# EAGLE design Cansat2019_3279_Container_v01 (EAGLE 7.3.0)
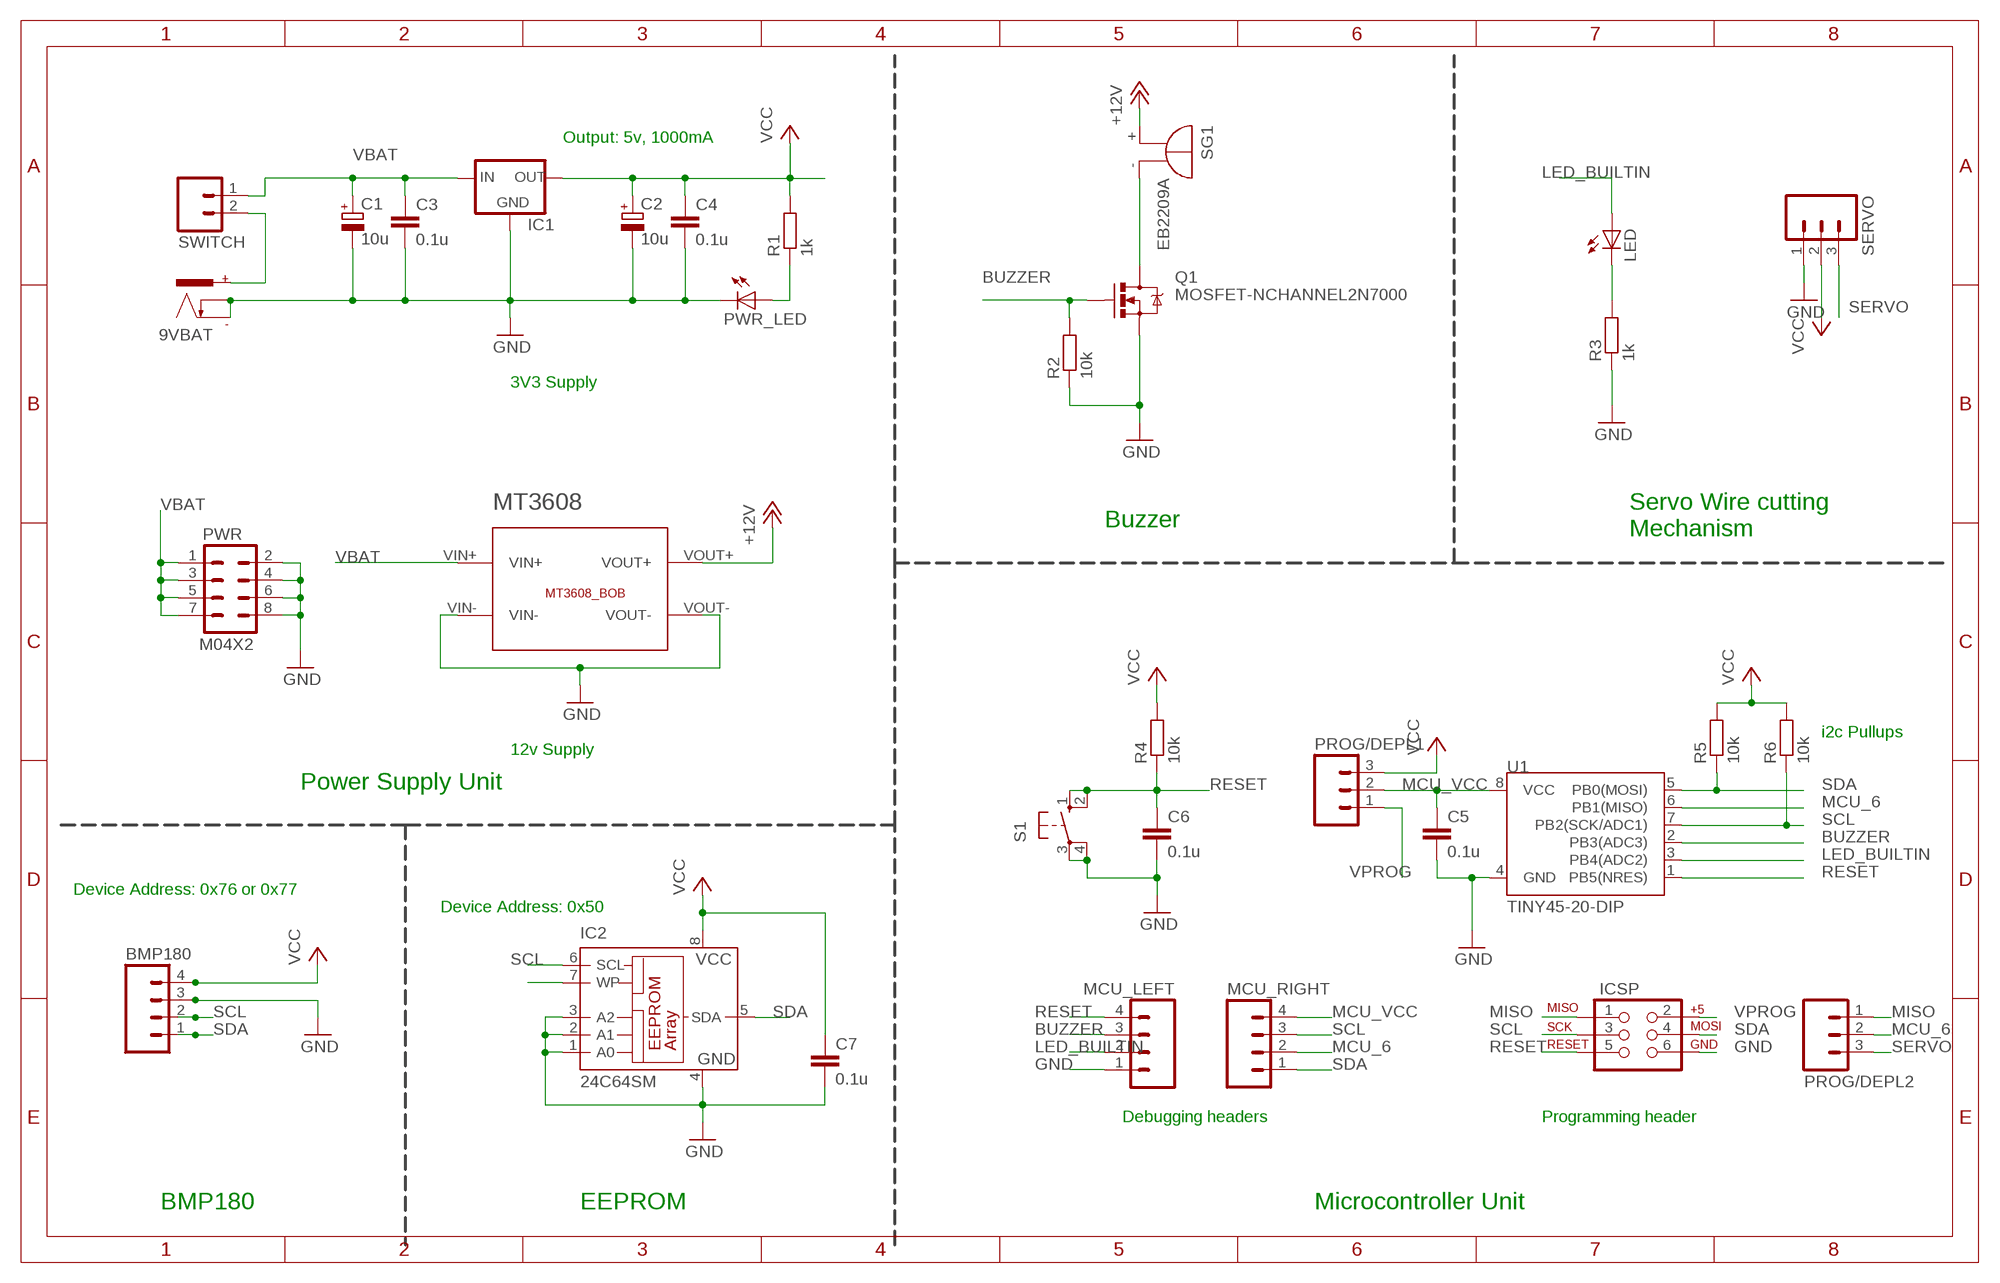
[diagram p0: schematic, sheet 1]

## Parts
9VBAT  POWER_CON  [NEB21R]
BMP180  M04  [04P]
C1  10u  CPOL-EUE2.5-6  [E2,5-6]
C2  10u  CPOL-EUE2.5-6  [E2,5-6]
C3  0.1u  C-EU025-025X050  [C025-025X050]
C4  0.1u  C-EU025-025X050  [C025-025X050]
C5  0.1u  C-EU025-025X050  [C025-025X050]
C6  0.1u  C-EU025-025X050  [C025-025X050]
C7  0.1u  C-EU025-025X050  [C025-025X050]
IC1  V_REG_78XX-TO-220  [TO-220-ALT]
IC2  24C64SM  [SO-08M]
ICSP  AVR_SPI_PRG_6NS  [2X3-NS]
LED  LED3MM  [LED3MM]
MCU_LEFT  M04  [04P]
MCU_RIGHT  M04  [04P]
MT3608  MT3608_BOB  [MT3608_BOB]
PROG/DEPL1  M03PTH  [1X03]
PROG/DEPL2  M03PTH  [1X03]
PWR  M04X2  [2X4]
PWR_LED  LED3MM  [LED3MM]
Q1  MOSFET-NCHANNEL2N7000  [TO-92]
R1  1k  R-EU_0204/7  [0204/7]
R2  10k  R-EU_0204/7  [0204/7]
R3  1k  R-EU_0204/7  [0204/7]
R4  10k  R-EU_0204/7  [0204/7]
R5  10k  R-EU_0204/7  [0204/7]
R6  10k  R-EU_0204/7  [0204/7]
S1  PUSH-BUTTON-6MM  [B3F-10XX]
SERVO  M03  [03P]
SG1  EB2209A  [EB2209A]
SWITCH  M02  [02P]
U1  TINY45-20-DIP  ATTINY45TINY45-20-DIP  [DIP08]

## Nets
+12V [power]: MT3608.VOUT+ SG1.+
BUZZER: MCU_LEFT.3 Q1.2(G) R2.2 U1.2(PB3(ADC3))
GND [power]: 9VBAT.- 9VBAT.C BMP180.3 C1.- C2.- C3.2 C4.2 C5.2 C6.2 C7.2 IC1.GND IC2.1(A0) IC2.2(A1) IC2.3(A2) IC2.4(GND) ICSP.6 MCU_LEFT.1 MT3608.VIN- MT3608.VOUT- PWR.2 PWR.4 PWR.6 PWR.8 PWR_LED.K(C) Q1.1(S) R2.1 R3.1 S1.3(P) S1.4(P1) SERVO.1 U1.4(GND)
LED_BUILTIN: LED.A MCU_LEFT.2 U1.3(PB4(ADC2))
MCU_6: MCU_RIGHT.2 PROG/DEPL2.2 U1.6(PB1(MISO))
MCU_VCC [power]: C5.1 MCU_RIGHT.4 PROG/DEPL1.2 U1.8(VCC)
MISO: ICSP.1 PROG/DEPL2.1
N$1 [power]: Q1.3(D) SG1.-
N$2: LED.K(C) R3.2
N$3: PWR_LED.A R1.1
N$6 [burner]: 9VBAT.+ SWITCH.2
N$8: IC2.7(WP)
RESET: C6.1 ICSP.5 MCU_LEFT.4 R4.1 S1.1(S) S1.2(S1) U1.1(PB5(NRES))
SCL: BMP180.2 IC2.6(SCL) ICSP.3 MCU_RIGHT.3 R6.1 U1.7(PB2(SCK/ADC1))
SDA: BMP180.1 IC2.5(SDA) ICSP.4 MCU_RIGHT.1 R5.1 U1.5(PB0(MOSI))
SERVO: PROG/DEPL2.3 SERVO.3
VBAT [power]: C1.+ C3.1 IC1.IN MT3608.VIN+ PWR.1 PWR.3 PWR.5 PWR.7 SWITCH.1
VCC [power]: BMP180.4 C2.+ C4.1 C7.1 IC1.OUT IC2.8(VCC) PROG/DEPL1.3 R1.2 R4.2 R5.2 R6.2 SERVO.2
VPROG [power]: ICSP.2 PROG/DEPL1.1

## Notes on the sheet
- Output: 5v, 1000mA
- 3V3 Supply
- Buzzer
- Servo Wire cutting
  Mechanism
- i2c Pullups
- 12v Supply
- Power Supply Unit
- Device Address: 0x76 or 0x77
- Device Address: 0x50
- Debugging headers | Programming header
- BMP180 | EEPROM | Microcontroller Unit

## Library data of the parts
9VBAT = CEDT_JANUARY_2015_v5:POWER_CON: DC Power Connector
BMP180 MCU_LEFT MCU_RIGHT = con-amp-quick:M04: AMP QUICK CONNECTOR; OC_FARNELL: unknown; OC_NEWARK: unknown
C1 C2 = rcl:CPOL-EU: POLARIZED CAPACITOR, European symbol
C3-C7 = rcl:C-EU: CAPACITOR, European symbol
IC1 = 1 - Jim:V_REG_78XX: Voltage Regulator Standard 7805 5V regulator. IGO (Input Ground Output). Spark Fun Electronics SKU : COM-00107
IC2 = microchip:24*: Serial EEPROM I2C; MF: RAMTRON INTERNATIONAL CORP; MPN: FM24C64-S; OC_FARNELL: 9882685; OC_NEWARK: 98H0189
ICSP = SparkFun-Connectors:AVR_SPI_PRG_6: AVR ISP 6 Pin This is the reduced ISP connector for AVR programming. Common on Arduino. This footprint will take up less PCB space and can be used with a 10-pin to 6-pin adapter such as SKU: BOB-08508 **Special note about "TEST_POINT" package. The stop mask is on the top side, so if you want your programming test points to be on the bottom of your board, make sure to place this package on the bottom side of the board. This also ensure that the orientation to program from the bottom side will be correct.
LED PWR_LED = 01_adafruit:LED: LED OSRAM: - CHIPLED LG R971, LG N971, LY N971, LG Q971, LY Q971, LO R971, LY R971 LH N974, LH R974 LS Q976, LO Q976, LY Q976 LO Q996 - Hyper CHIPLED LW Q18S LB Q993, LB Q99A, LB R99A - SideLED LS A670, LO A670, LY A670, LG A670, LP A670 LB A673, LV A673, LT A673, LW A673 LH A674 LY A675 LS A676, LA A676, LO A676, LY A676, LW A676 LS A679, LY A679, LG A679 - Hyper Micro SIDELED® LS Y876, LA Y876, LO Y876, LY Y876 LT Y87S - SmartLED LW L88C, LW L88S LB L89C, LB L89S, LG L890 LS L89K, LO L89K, LY L89K LS L896, LA L896, LO L896, LY L896 - TOPLED LS T670, LO T670, LY T670, LG T670, LP T670 LSG T670, LSP T670, LSY T670, LOP T670, LYG T670 LG T671, LOG T671, LSG T671 LB T673, LV T673, LT T673, LW T673 LH T674 LS T676, LA T676, LO T676, LY T676, LB T676, LH T676, LSB T676, LW T676 LB T67C, LV T67C, LT T67C, LS T67K, LO T67K, LY T67K, LW E67C LS E67B, LA E67B, LO E67B, LY E67B, LB E67C, LV E67C, LT E67C LW T67C LS T679, LY T679, LG T679 LS T770, LO T770, LY T770, LG T770, LP T770 LB T773, LV T773, LT T773, LW T773 LH T774 LS E675, LA E675, LY E675, LS T675 LS T776, LA T776, LO T776, LY T776, LB T776 LHGB T686 LT T68C, LB T68C - Hyper Mini TOPLED® LB M676 - Mini TOPLED Santana® LG M470 LS M47K, LO M47K, LY M47K Source: http://www.osram.convergy.de/
MT3608 = Breakouts:MT3608_BOB
PROG/DEPL1 PROG/DEPL2 = SparkFun-Connectors:M03: Header 3 Standard 3-pin 0.1" header. Use with straight break away headers (SKU : PRT-00116), right angle break away headers (PRT-00553), swiss pins (PRT-00743), machine pins (PRT-00117), and female headers (PRT-00115). Molex polarized connector foot print use with SKU : PRT-08232 with associated crimp pins and housings.
PWR = SparkFun-Connectors:M04X2: .1" header, two rows of four.
Q1 = SparkFun-DiscreteSemi:MOSFET-NCHANNEL: Common NMOSFET Parts MFG P/N Store ID Prod ID FDD8780 TRANS-09984 SI7820DN TRANS-11055 FDS6630A IC-08089 2N7002PW TRANS-11151 FQP30N06L COM-10213 TRANS-10060 BSS123LT1G TRANS-08345 BSS138 TRANS-00830 BS170 2N7000
R1-R6 = rcl:R-EU_: RESISTOR, European symbol
S1 = msp framework:PUSH-BUTTON: Tactile Switch Momentary Push to ON switch Omron B3F 10-xx & 40-xx Datasheet <http://www.omron.com/ecb/products/pdf/en-b3f.pdf>; SUNROM: 3951
SERVO = msp framework:M03: AMP QUICK CONNECTOR
SG1 = buzzer:EB2209A: BUZZER Source: Buerklin; OC_FARNELL: unknown; OC_NEWARK: unknown
SWITCH = CEDT_JANUARY_2015_v5:M02: AMP QUICK CONNECTOR
U1 = SparkFun-DigitalIC:ATTINY45: Atmel 8-pin 2/4/8kB flash uC; PROD_ID: IC-09439

## Net classes
0 default: width 0.305 mm, clearance 0.305 mm
1 power: width 0.61 mm, clearance 0.305 mm
2 burner: width 0.813 mm, clearance 0.305 mm

## Board
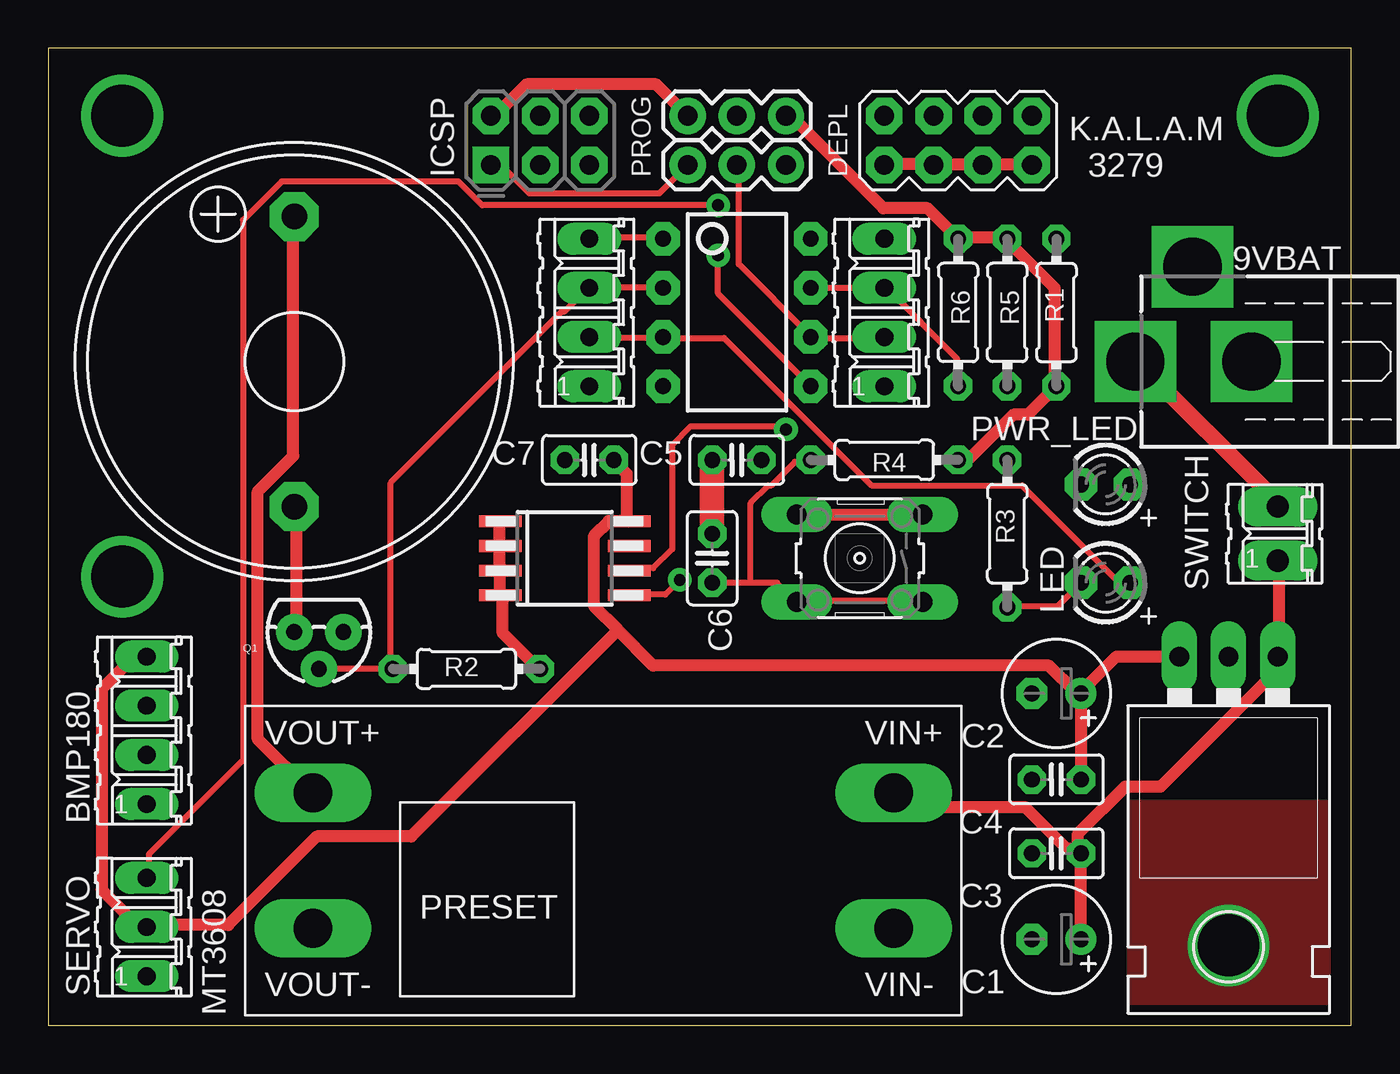
[diagram p1: board, top side]
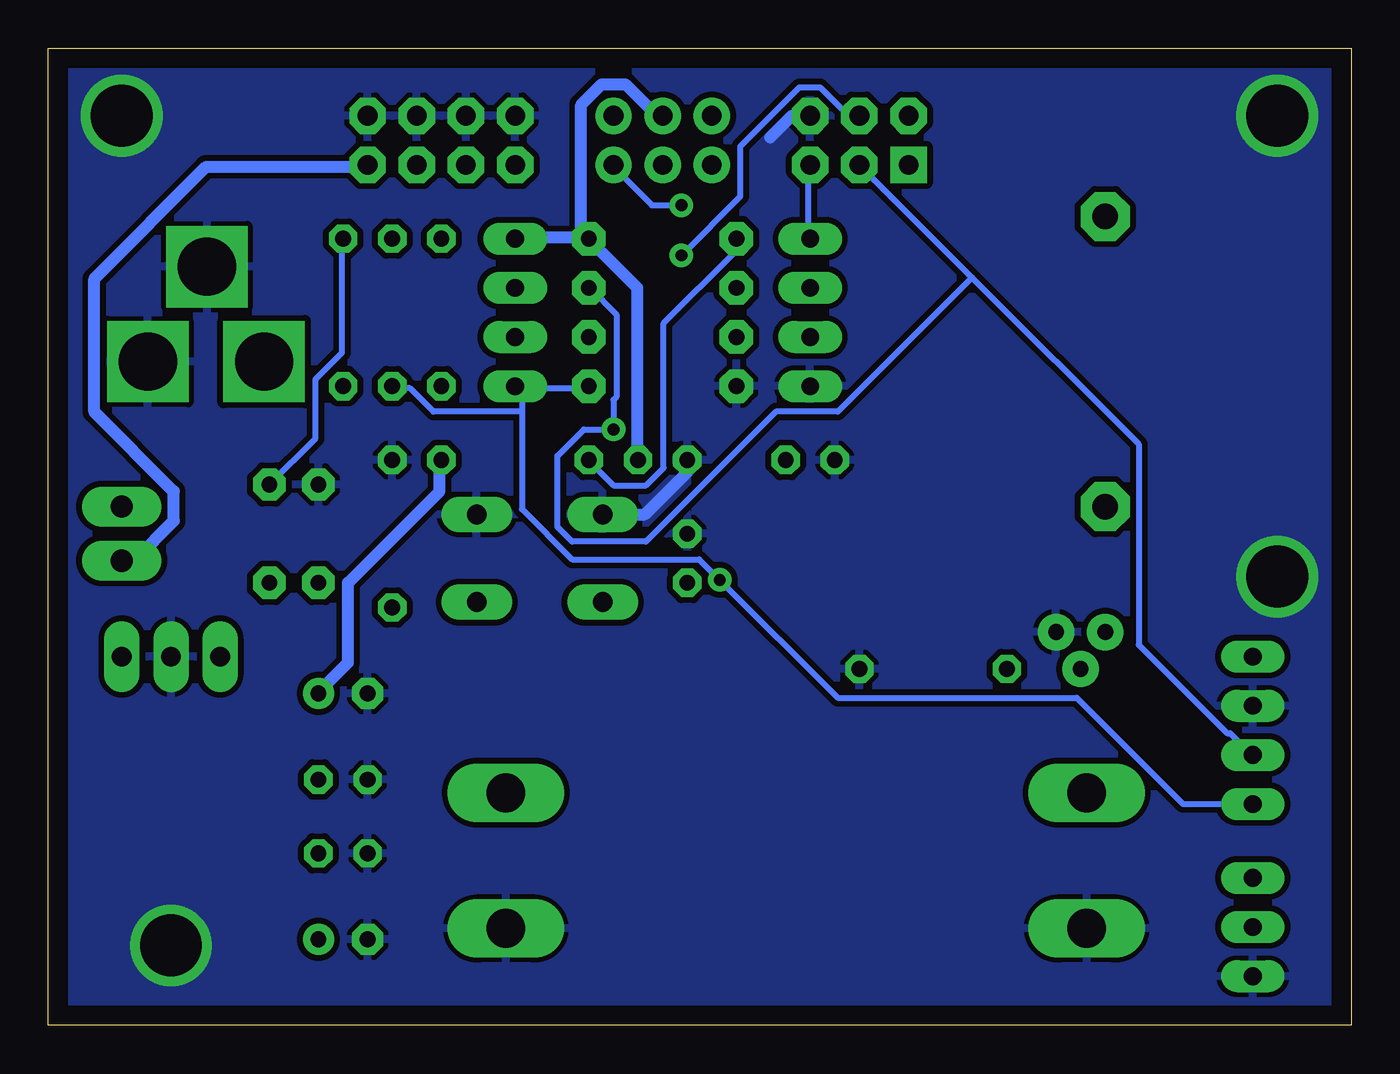
[diagram p2: board, bottom side, seen from below]

Size 67.29 x 50.47 mm. Coordinates in mm from the lower left corner, seen from the top.
Outline: 0,0 67.29,0 67.29,50.47 0,50.47 0,0
Copper layers (1*16): Top 0.035mm / dielectric 1.5mm / Bottom 0.035mm
Design rules "8085_board": minimum track width 10mil, minimum drill 24mil, track to track 8mil, track to pad 8mil, pad to pad 8mil, via to via 8mil, smd to smd 8mil, copper to edge 40mil, drill to drill 8mil, minimum pad ring 12mil, minimum via ring 12mil, stop-mask expansion 4mil, vias tented up to drill 0mil, thermal gap 10mil

### Footprints (pad centres in the part's own frame; a part is rotated, then mirrored left to right if it is on the bottom)
NEB21R = drill 3 pad 4.2 square: + 0,3.54; - 0,-2.46; C 4.9,0.59
04P = drill 0.914 long: 1 -3.81,0; 2 -1.27,0; 3 1.27,0; 4 3.81,0
E2,5-6 = drill 0.813 pad 1.6: + -1.27,0 | drill 0.813 pad 1.6 octagon: - 1.27,0
C025-025X050 = drill 0.813 octagon: 1 -1.27,0; 2 1.27,0
TO-220-ALT = drill 1.016 long: GND 0,-3.81; IN -2.54,-3.81; OUT 2.54,-3.81
SO-08M = smd 0.6 x 2.2: 1 -1.905,-3.33; 2 -0.635,-3.33; 3 0.635,-3.33; 4 1.905,-3.33; 5 1.905,3.33; 6 0.635,3.33; 7 -0.635,3.33; 8 -1.905,3.33
2X3-NS = drill 1.016 pad 1.88 square: 1 -2.54,-1.27 | drill 1.016 pad 1.88 octagon: 2 -2.54,1.27; 3 0,-1.27; 4 0,1.27; 5 2.54,-1.27; 6 2.54,1.27
LED3MM = drill 0.813 pad 1.676 octagon: A -1.27,0; K 1.27,0
MT3608_BOB = drill 2 pad 3 long: VIN+ 33.5,-4.5; VIN- 33.5,-11.5; VOUT+ 3.5,-4.5; VOUT- 3.5,-11.5
1X03 = drill 1.016 pad 1.88: 1 0,0; 2 2.54,0; 3 5.08,0
2X4 = drill 1.016 pad 1.88 octagon: 1 -3.81,-1.27; 2 -3.81,1.27; 3 -1.27,-1.27; 4 -1.27,1.27; 5 1.27,-1.27; 6 1.27,1.27; 7 3.81,-1.27; 8 3.81,1.27
TO-92 = drill 0.813 pad 1.88: 1 -1.27,0; 2 0,1.905; 3 1.27,0
0204/7 = drill 0.813 octagon: 1 -3.81,0; 2 3.81,0
B3F-10XX = drill 1.016 long: 1 -3.251,2.261; 2 3.251,2.261; 3 -3.251,-2.261; 4 3.251,-2.261
03P = drill 0.914 long: 1 -2.54,0; 2 0,0; 3 2.54,0
EB2209A = drill 1.321 pad 2.54 octagon: + 7.493,0; - -7.493,0
02P = drill 1.143 long: 1 -1.397,0; 2 1.397,0
DIP08 = drill 0.813 pad 1.727 octagon: 1 -3.81,-3.81; 2 -1.27,-3.81; 3 1.27,-3.81; 4 3.81,-3.81; 5 3.81,3.81; 6 1.27,3.81; 7 -1.27,3.81; 8 -3.81,3.81

### Placement (x,y rotation side)
9VBAT  59.69,34.29 90 top
BMP180  5.08,15.24 90 top
C1  52.07,4.45 180 top
C2  52.07,17.14 180 top
C3  52.07,8.89 180 top
C4  52.07,12.7 180 top
C5  35.56,29.21 180 top
C6  34.29,24.13 90 top
C7  27.94,29.21 180 top
IC1  60.96,15.24 180 top
IC2  26.67,24.13 270 top
ICSP  25.4,45.72 0 top
LED  54.61,22.86 180 top
MCU_LEFT  27.94,36.83 90 top
MCU_RIGHT  43.18,36.83 90 top
MT3608  10.16,16.51 0 top
PROG/DEPL1  33.02,46.99 0 top
PROG/DEPL2  33.02,44.45 0 top
PWR  46.99,45.72 0 top
PWR_LED  54.61,27.94 180 top
Q1  13.97,20.32 180 top
R1  52.07,36.83 270 top
R2  21.59,18.41 180 top
R3  49.53,25.4 270 top
R4  43.18,29.21 0 top
R5  49.53,36.83 90 top
R6  46.99,36.83 90 top
S1  41.91,24.13 180 top
SERVO  5.08,5.08 90 top
SG1  12.7,34.29 90 top
SWITCH  63.5,25.4 90 top
U1  35.56,36.83 270 top

### Tracks (layer width: path | path; a pad name or v marks a point on that pad's centre or on a via)
+12V
  Top 0.61: SG1.+ 12.65,41.76 12.65,29.41 10.82,27.58 10.82,14.78 13.56,12.04 MT3608.VOUT+
BUZZER
  Top 0.305: U1.2 MCU_LEFT.3 27.89,38.1 26.67,36.88 26.52,36.88 17.68,28.04 17.68,18.59 R2.2 17.68,18.44 14.02,18.44 Q1.2
GND  (via drill 3.2)
  Top 0.61: IC2.1 23.32,25.91 23.32,24.99 IC2.2 23.32,24.69 23.32,23.77 IC2.3 23.32,23.47 23.32,22.25 IC2.4 23.47,21.95 23.47,20.27 25.3,18.44 R2.1 | S1.4 S1.3
  Top 1.27: C6.2 C5.2
  Bottom 0.61: S1.4 36.47,26.39 34.29,28.57 C5.2 | ICSP.6 28.89,46.99 30,45.88
  other vias: 3.81,46.99 63.5,46.99 3.81,23.18 60.96,4.13
  pour Bottom: -2.54,52.07 69.85,52.07 69.85,-1.27 -2.54,-1.27
  pour Top: 55.88,1.27 66.04,1.27 66.04,11.43 55.88,11.43
  pour Bottom: 55.88,1.27 66.04,1.27 66.04,11.43 55.88,11.43
LED_BUILTIN
  Top 0.305: MCU_LEFT.2 28.04,35.51 31.7,35.51 U1.3 31.85,35.51 34.9,35.51 42.52,27.89 50.29,27.89 55.32,22.86 LED.A
MCU_6
  Top 0.305: MCU_RIGHT.2 43.13,35.51 39.47,35.51 U1.6 39.32,35.66 35.66,39.32 35.66,44.35 PROG/DEPL2.2
MCU_VCC
  Bottom 0.61: C5.1 36.88,29.26 36.88,38.1 39.32,40.54 U1.8 | MCU_RIGHT.4 43.13,40.69 39.62,40.69 U1.8 | PROG/DEPL1.2 35.66,47.09 35.97,47.09 37.49,48.62 38.71,48.62 39.78,47.55 39.78,40.84 U1.8
MISO
  Top 0.305: PROG/DEPL2.1 31.55,42.98 24.84,42.98 23.47,44.35 22.86,44.35 ICSP.1
N$1
  Top 0.61: Q1.3 12.8,20.42 12.8,26.67 SG1.-
N$2
  Top 0.305: LED.K 52.12,21.64 49.53,21.64 R3.2
N$3
  Bottom 0.305: PWR_LED.A 53.49,30.33 53.49,33.38 52.12,34.75 52.12,40.54 R1.1
N$6
  Top 0.813: SWITCH.2 63.4,26.82 63.4,27.13 56.24,34.29 9VBAT.+
RESET
  Top 0.305: MCU_LEFT.4 28.04,40.69 31.7,40.69 U1.1 | 36.27,22.86 37.64,22.86 38.56,21.95 S1.2 38.71,21.95 45.11,21.95 S1.1 | 36.27,22.86 C6.1 | 36.27,22.86 36.27,26.98 37.19,27.89 37.34,27.89 38.56,29.11 39.32,29.11 R4.1
  Bottom 0.305: ICSP.5 28.04,44.35 28.04,40.69 MCU_LEFT.4 | U1.1 31.85,40.54 31.85,39.93 35.51,36.27 35.51,28.8 36.42,27.89 38.1,27.89 39.32,29.11 R4.1
SCL  (via drill 0.61)
  Top 0.305: R6.1 46.94,33.07 46.94,34.44 43.28,38.1 MCU_RIGHT.3 U1.7 | IC2.6 30.02,23.62 31.24,23.62 32.23,24.61 32.23,30 33.18,30.96 37.93,30.96 v38.1,30.79
  Bottom 0.305: U1.7 39.32,38.1 37.95,36.73 37.95,32.46 38.1,32.31 v38.1,30.79 39.62,30.79 41,29.41 41,25.76 40.23,24.99 36.42,24.99 29.72,31.7 26.52,31.7 19.58,38.63 | ICSP.3 19.58,38.63 | 19.58,38.63 10.97,30.02 10.97,19.66 6.4,15.09 6.25,15.09 5.18,14.02 BMP180.2
SDA  (via drill 0.61)
  Top 0.305: v32.61,23.01 31.85,22.25 30.02,22.25 IC2.5 | v34.59,39.78 34.59,37.8 U1.5
  Bottom 0.305: 42.82,31.7 42.82,32.61 43.13,32.92 MCU_RIGHT.1 42.98,32.92 39.47,32.92 U1.5 | 42.82,31.7 42.82,26.67 40.23,24.08 33.68,24.08 v32.61,23.01 26.52,16.92 14.17,16.92 8.69,11.43 BMP180.1 | 42.82,31.7 47.4,31.7 48.62,32.92 49.53,32.92 R5.1 | v34.59,39.78 31.55,42.82 31.55,45.41 28.5,48.46 27.43,48.46 26.06,47.09 25.45,47.09 ICSP.4
SERVO  (via drill 0.61)
  Top 0.305: v34.59,42.37 22.4,42.37 21.18,43.59 12.04,43.59 10.06,41.6 10.06,13.72 5.18,8.84 5.18,7.62 SERVO.3
  Bottom 0.305: v34.59,42.37 36.12,42.37 38.1,44.35 PROG/DEPL2.3
VBAT
  Top 0.61: PWR.1 43.28,44.5 45.72,44.5 PWR.3 45.87,44.5 48.16,44.5 PWR.5 48.46,44.5 50.75,44.5 PWR.7 | SWITCH.1 63.55,23.93 63.55,19.05 IC1.IN 63.25,18.9 63.25,18.14 57.45,12.34 55.63,12.34 53.19,9.91 53.19,9.45 C3.1 | C1.+ C3.1 | C3.1 53.19,9.14 52.58,9.14 50.44,11.28 44.35,11.28 43.74,11.89 MT3608.VIN+
  Bottom 0.61: PWR.7 50.9,44.35 59.13,44.35 64.92,38.56 64.92,31.7 60.81,27.58 60.81,26.06 62.79,24.08 63.4,24.08 SWITCH.1
VCC
  Top 0.61: 4.45,19.05 BMP180.4 4.27,18.9 2.74,17.37 2.74,7.01 4.57,5.18 5.03,5.18 SERVO.2 5.33,5.18 9.3,5.18 13.87,9.75 18.75,9.75 29.41,20.42 | R4.2 47.09,29.26 47.55,29.26 49.84,31.55 50.6,31.55 R1.2 51.97,33.22 51.97,38.1 49.68,40.39 R5.2 49.53,40.69 47.09,40.69 R6.2 45.41,42.22 43.13,42.22 38.41,46.94 38.1,46.94 PROG/DEPL1.3 | C7.1 29.26,29.11 29.87,28.5 29.87,26.06 IC2.8 29.57,26.06 28.96,26.06 28.19,25.3 28.19,21.64 29.41,20.42 | C2.+ C4.1 | IC1.OUT 55.17,19.05 53.49,17.37 C2.+ | 29.41,20.42 31.24,18.59 51.66,18.59 53.03,17.22 C2.+
  Bottom 0.61: R4.2 47.09,29.11 47.09,27.58 51.82,22.86 51.82,18.75 53.34,17.22 C2.+
VPROG
  Top 0.61: PROG/DEPL1.1 31.39,48.62 24.69,48.62 23.16,47.09 22.86,47.09 ICSP.2

### Text on the board
tNames: PROG | DEPL | K.A.L.A.M / 3279